# Altium schematic sheet Headers.SchDoc
size A4
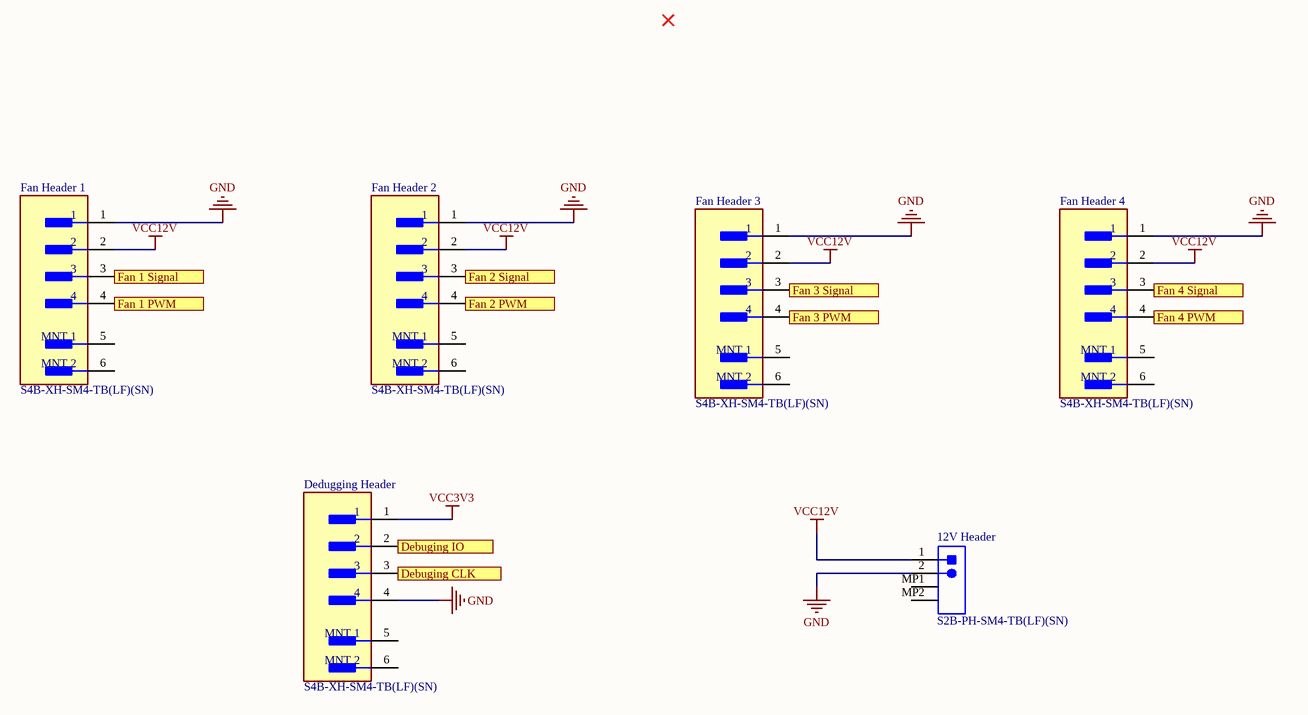
[diagram p0: Headers.SchDoc]

## Parts
12V_Header  S2B-PH-SM4-TB(LF)(SN)  [JST- S2B-PH-SM4-TB(LF)(SN)-2_V]
Dedugging_Header  S4B-XH-SM4-TB(LF)(SN)  [FP-S4B-XH-SM4-TB_LF_SN-MFG]
Fan_Header_1  S4B-XH-SM4-TB(LF)(SN)  [FP-S4B-XH-SM4-TB_LF_SN-MFG]
Fan_Header_2  S4B-XH-SM4-TB(LF)(SN)  [FP-S4B-XH-SM4-TB_LF_SN-MFG]
Fan_Header_3  S4B-XH-SM4-TB(LF)(SN)  [FP-S4B-XH-SM4-TB_LF_SN-MFG]
Fan_Header_4  S4B-XH-SM4-TB(LF)(SN)  [FP-S4B-XH-SM4-TB_LF_SN-MFG]

## Ports
Debuging CLK, Debuging IO, Fan 1 PWM, Fan 1 Signal, Fan 2 PWM, Fan 2 Signal (out), Fan 3 PWM, Fan 3 Signal, Fan 4 PWM, Fan 4 Signal

## Nets
GND: 12V_Header.2 Dedugging_Header.4 Fan_Header_1.1 Fan_Header_2.1 Fan_Header_3.1 Fan_Header_4.1
VCC3V3: Dedugging_Header.1
VCC12V: 12V_Header.1 Fan_Header_1.2 Fan_Header_2.2 Fan_Header_3.2 Fan_Header_4.2
Debuging CLK: Dedugging_Header.3 ; port Debuging CLK
Debuging IO: Dedugging_Header.2 ; port Debuging IO
Fan 1 PWM: Fan_Header_1.4 ; port Fan 1 PWM
Fan 1 Signal: Fan_Header_1.3 ; port Fan 1 Signal
Fan 2 PWM: Fan_Header_2.4 ; port Fan 2 PWM
Fan 2 Signal: Fan_Header_2.3 ; port Fan 2 Signal
Fan 3 PWM: Fan_Header_3.4 ; port Fan 3 PWM
Fan 3 Signal: Fan_Header_3.3 ; port Fan 3 Signal
Fan 4 PWM: Fan_Header_4.4 ; port Fan 4 PWM
Fan 4 Signal: Fan_Header_4.3 ; port Fan 4 Signal

Not connected (* = marked no-connect by the designer): 12V_Header MP1 MP2; Dedugging_Header 5(MNT_1) 6(MNT_2); Fan_Header_1 5(MNT_1) 6(MNT_2); Fan_Header_2 5(MNT_1) 6(MNT_2); Fan_Header_3 5(MNT_1) 6(MNT_2); Fan_Header_4 5(MNT_1) 6(MNT_2)

## Library data of the parts
12V_Header = CMP-1755-00001-1: Male Header, Pitch 2 mm, 1 x 2 Position, Height 5.5 mm, -25 to 85 degC, RoHS, Tape and Reel; Current Rating: 3 A; ComponentLink1URL: http://www.jst.com/home2.html; Radiation Hardening: No; RoHSCompliant: True; Mount: Through Hole; Contact Material: Bronze; Package Quantity: 100; Width: 2.34 mm; DatasheetVersion: Dec-12; Height: 8.13 mm; Max Operating Temperature: 105degC; ComponentLink2Description: Datasheet; Lead Pitch: 0.1 inch; Contact Finish: Lead; Packaging: Bulk; Colour: Black; Contact Plating: Tin; Min Operating Temperature: -65degC; ComponentLink1Description: Manufacturer URL; PackageReference: S2B-PH-SM4-TB(LF)(SN)-2; PackageDescription: Male Header, Pitch 2 mm, 1 x 2 Position, Height 5.5 mm; ComponentLink2URL: http://www.jst-mfg.com/product/pdf/eng/ePH.pdf; Pins: 40; Length: 101.19 mm
Dedugging_Header Fan_Header_1-Fan_Header_4 = CMP-17439-000072-1: CONN HEADER SMD R/A 4POS 2.5MM; Number of Positions: 4; Max Current Rating: 3A; Max Voltage Rating (AC): 250V; Connector Type: Male Pin; Contact Resistance: 20mR; Gender: Male; Pitch: 0.098inch; Max Operating Temperature: 85°C; Contact Plating: Tin; Housing Material: Polyamide; Housing Color: Beige; Depth: 10mm; Series: XH; Package Quantity: 1; Length: 15mm; Contact Material: Copper Alloy; Min Operating Temperature: -25°C; REACH SVHC: No SVHC; Orientation: Right Angle; Number of Rows: 1; Contact Type: Male Pin; Color: Natural; Lead Free: Lead Free; Termination: Solder; Mount: Surface Mount; Number of Contacts: 4; Packaging: Tape and Reel